# Altium schematic sheet 11_PoE_USB_PD.SchDoc: PoE and USB PD (part 1 of 3)
size A3; Organization: Lime Microsystems; Address1: Surrey Tech Centre; Address2: Guildford GU2 7YG; Address3: Surrey; Address4: United Kingdom; Revision: v1.0; SheetNumber: 11; SheetTotal: 12
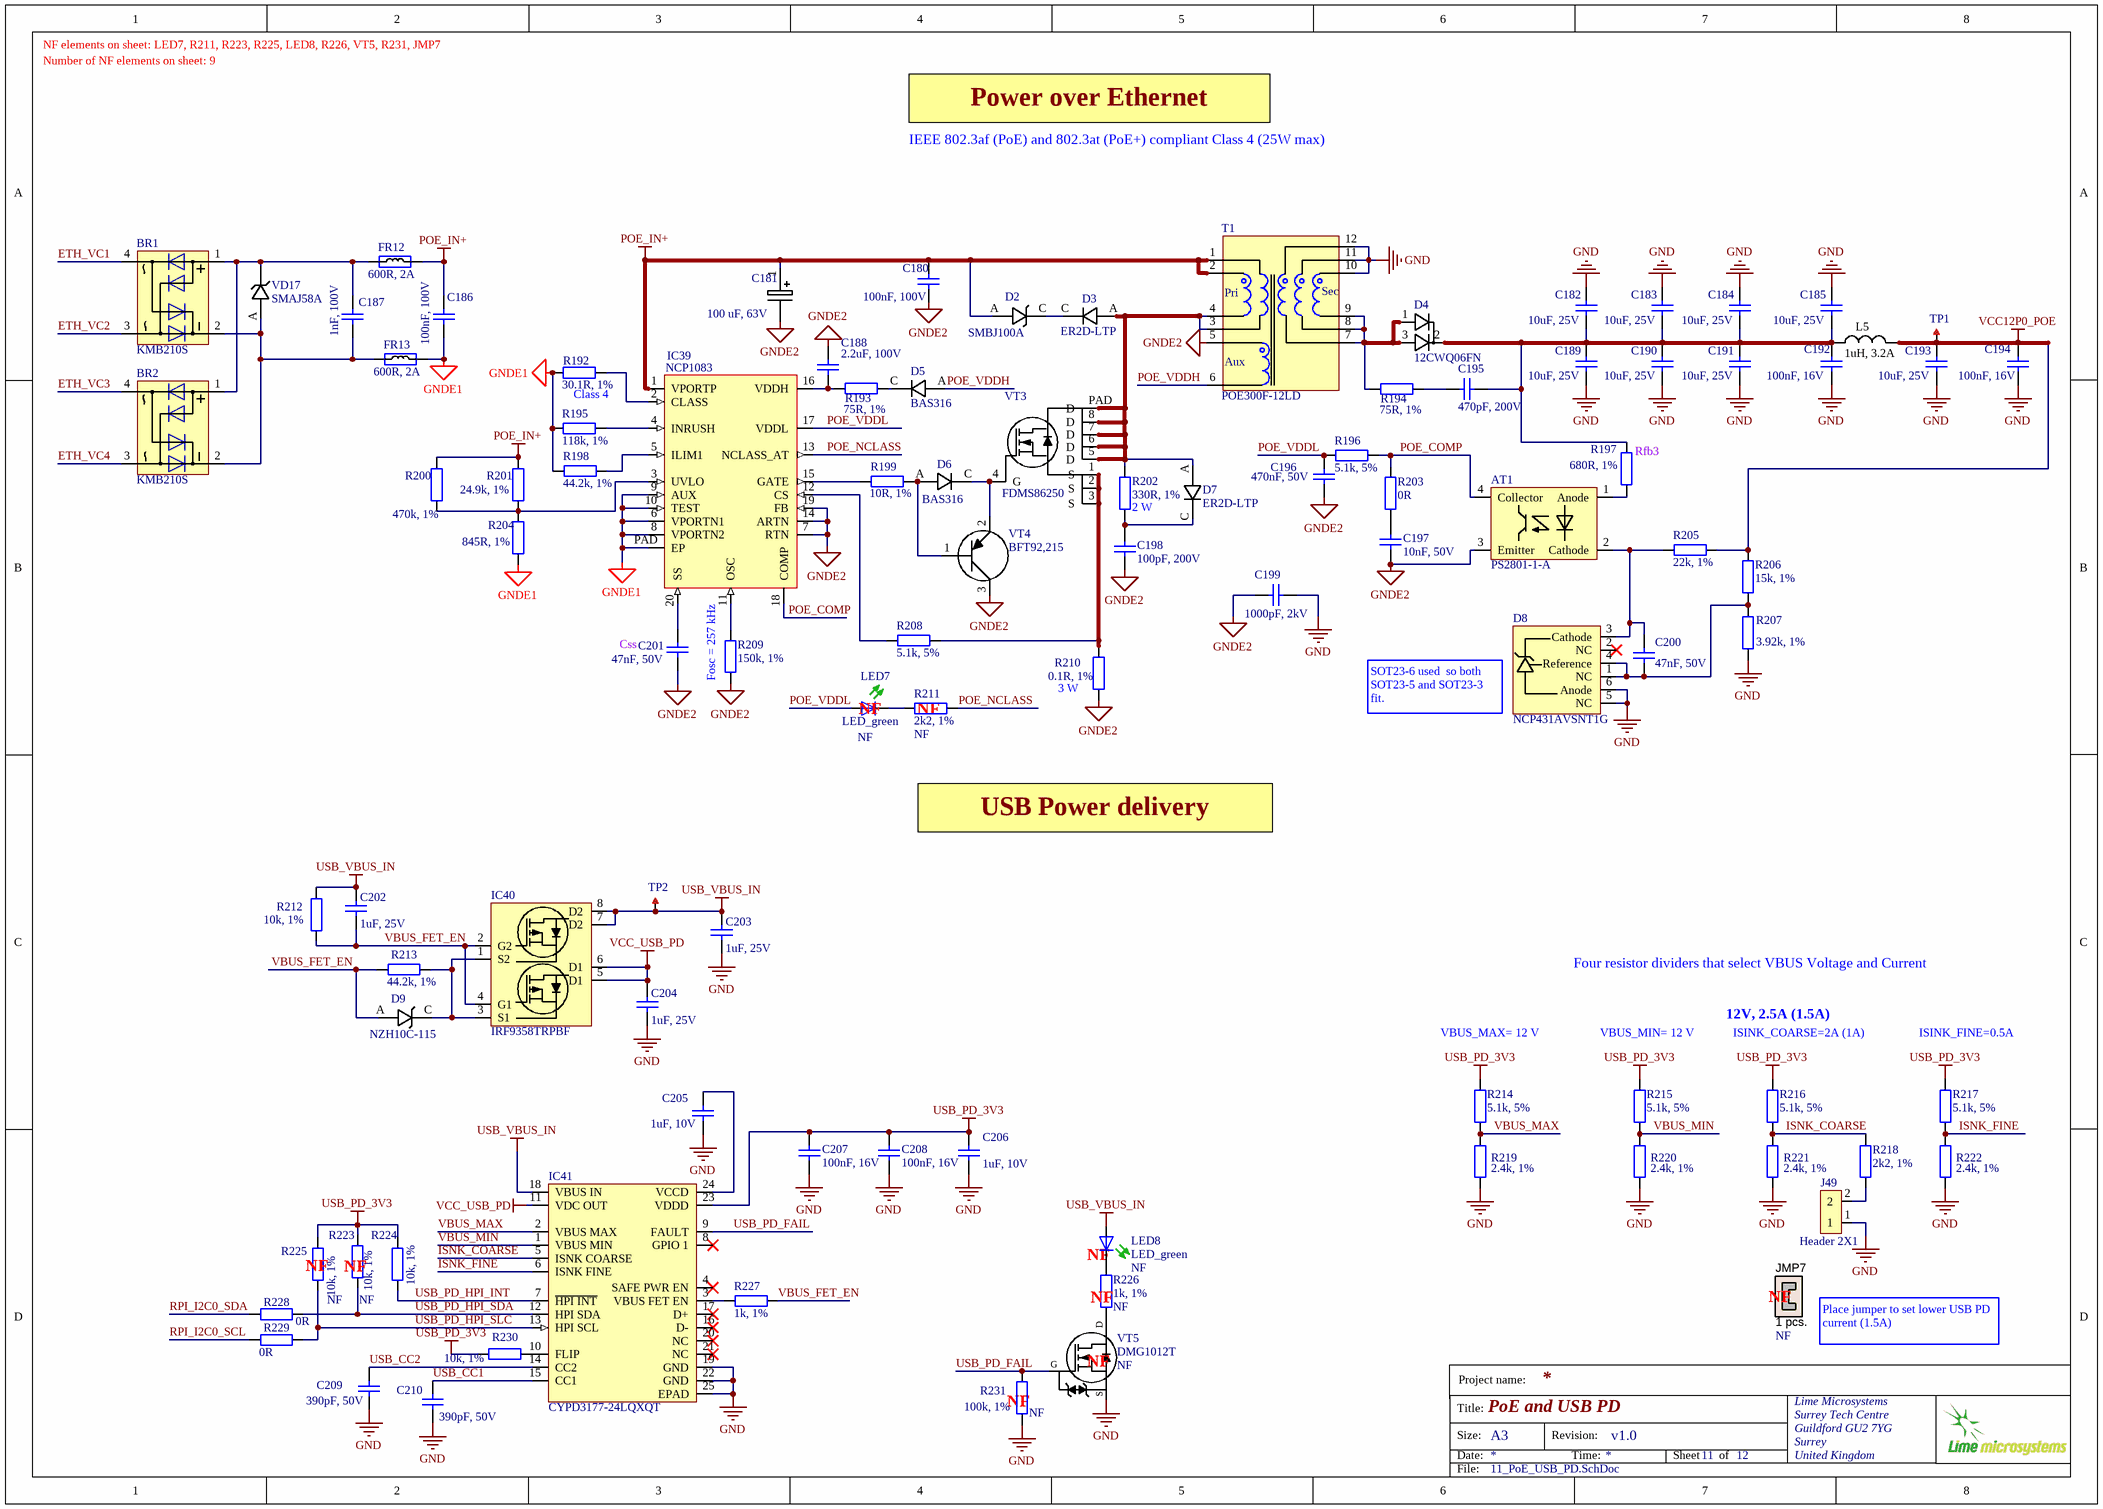
[diagram p0: 11_PoE_USB_PD.SchDoc]

## Parts
AT1  PS2801-1-A  [TCMT1107CT_optoisolator]
BR1  KMB210S  [KMB210S_RECTIFIER_BRIDGE]
BR2  KMB210S  [KMB210S_RECTIFIER_BRIDGE]
C180  100nF, 100V  [CAP0603]
C181  100 uF, 63V  [CAP_POL_D10_H10]
C182  10uF, 25V  [CAP0805]
C183  10uF, 25V  [CAP0805]
C184  10uF, 25V  [CAP0805]
C185  10uF, 25V  [CAP0805]
C186  100nF, 100V  [CAP0603]
C187  1nF, 100V  [CAP0603]
C188  2.2uF, 100V  [CAP1206]
C189  10uF, 25V  [CAP0805]
C190  10uF, 25V  [CAP0805]
C191  10uF, 25V  [CAP0805]
C192  100nF, 16V  [CAP0402]
C193  10uF, 25V  [CAP0805]
C194  100nF, 16V  [CAP0402]
C195  470pF, 200V  [CAP0603]
C196  470nF, 50V  [CAP0402]
C197  10nF, 50V  [CAP0402]
C198  100pF, 200V  [CAP0402]
C199  1000pF, 2kV  [CAP1812]
C200  47nF, 50V  [CAP0603]
C201  47nF, 50V  [CAP0603]
C202  1uF, 25V  [CAP0603]
C203  1uF, 25V  [CAP0603]
C204  1uF, 25V  [CAP0603]
C205  1uF, 10V  [CAP0402]
C206  1uF, 10V  [CAP0402]
C207  100nF, 16V  [CAP0402]
C208  100nF, 16V  [CAP0402]
C209  390pF, 50V  [CAP0402]
C210  390pF, 50V  [CAP0402]
D2  SMBJ100A  [SMBJ100A_DIODE_DO-214AA]
D3  ER2D-LTP  [ER2D-LTP_DIODE_DO-214AA]
D4  12CWQ06FN  [12CWQ06FN_diode_array_DPAK]
D5  BAS316  [BAS316_DIODE_SOD323]
D6  BAS316  [BAS316_DIODE_SOD323]
D7  ER2D-LTP  [ER2D-LTP_DIODE_DO-214AA]
D8  NCP431AVSNT1G  [SOT23-6]
D9  NZH10C-115  [NZH10C,115_shottky_diode_SOD123]
FR12  600R, 2A  [RES0805]
FR13  600R, 2A  [RES0805]
IC39  NCP1083  [NCP1083_PoE_controller_TSSOP20]
IC40  IRF9358TRPBF  [IRF9358TRPBF_DUAL_NMOS_SOIC8]
IC41  CYPD3177-24LQXQT  [USB_POWER_DISTR_CYPD3177_QFN24]
J49  Header 2X1  [HDR_1x2]
JMP7  1 pcs.  Assembly Info: NF  (mechanical)
L5  1uH, 3.2A  [NRS4018T3R3MDGJ_inductor]
LED7  LED_green  Assembly Info: NF  [LED-0603-GREEN]
LED8  LED_green  Assembly Info: NF  [LED-0603-GREEN]
R192  30.1R, 1%  [RES0402]
R193  75R, 1%  [RES0402]
R194  75R, 1%  [RES0402]
R195  118k, 1%  [RES0402]
R196  5.1k, 5%  [RES0402]
R197  680R, 1%  [RES0402]
R198  44.2k, 1%  [RES0402]
R199  10R, 1%  [RES0603]
R200  470k, 1%  [RES0402]
R201  24.9k, 1%  [RES0402]
R202  330R, 1%  [RES0603]
R203  0R  [RES0402]
R204  845R, 1%  [RES0402]
R205  22k, 1%  [RES0402]
R206  15k, 1%  [RES0402]
R207  3.92k, 1%  [RES0402]
R208  5.1k, 5%  [RES0402]
R209  150k, 1%  [RES0402]
R210  0.1R, 1%  [RES2512]
R211  2k2, 1%  Assembly Info: NF  [RES0402]
R212  10k, 1%  [RES0402]
R213  44.2k, 1%  [RES0402]
R214  5.1k, 5%  [RES0402]
R215  5.1k, 5%  [RES0402]
R216  5.1k, 5%  [RES0402]
R217  5.1k, 5%  [RES0402]
R218  2k2, 1%  [RES0402]
R219  2.4k, 1%  [RES0402]
R220  2.4k, 1%  [RES0402]
R221  2.4k, 1%  [RES0402]
R222  2.4k, 1%  [RES0402]
R223  10k, 1%  Assembly Info: NF  [RES0402]
R224  10k, 1%  [RES0402]
R225  10k, 1%  Assembly Info: NF  [RES0402]
R226  1k, 1%  Assembly Info: NF  [RES0402]
R227  1k, 1%  [RES0402]
R228  0R  [RES0402]
R229  0R  [RES0402]
R230  10k, 1%  [RES0402]
R231  100k, 1%  Assembly Info: NF  [RES0402]
T1  POE300F-12LD  [POE300F50LD_TRANSFORMER]
TP1  TESTPOINT_PAD  [TP_PAD_1p5MM]  (value not drawn)  (no BOM)
TP2  TESTPOINT_PAD  [TP_PAD_1p5MM]  (value not drawn)  (no BOM)
VD17  SMAJ58A  [SMAJ58A_shottky_diode]
VT3  FDMS86250  [FDMS86250_NMOS_POWER56]
VT4  BFT92,215  [BFT92,215_PNP_STO23-3]
VT5  DMG1012T  Assembly Info: NF  [SOT523]

## Nets
GND: C182.2 C183.2 C184.2 C185.2 C189.1 C190.1 C191.1 C192.1 C193.1 C194.1 C199.1 C203.1 C204.1 C205.1 C206.1 C207.2 C208.2 C209.2 C210.2 D8.5(NC) D8.6(Anode) IC41.19(GND) IC41.22(GND) IC41.25(EPAD) J49.1 R207.2 R219.1 R220.1 R221.1 R222.1 R231.2 T1.10 T1.11 T1.12 VT5.S
GNDE1: C186.1 FR13.2 IC39.6(VPORTN1) IC39.8(VPORTN2) IC39.9(AUX) IC39.10(TEST) IC39.PAD(EP) R192.1 R195.1 R198.2 R204.2
GNDE2: AT1.3(Emitter) C180.1 C181.2 C188.2 C196.1 C197.1 C198.2 C199.2 C201.1 IC39.7(RTN) IC39.14(ARTN) IC39.19(FB) R209.2 R210.1 T1.5 VT4.3(C)
POE_IN+: C180.2 C181.1 C186.2 D2.A FR12.2 IC39.1(VPORTP) R200.2 R201.2 T1.1 T1.2
USB_PD_3V3: C206.2 C207.1 C208.1 IC41.23(VDDD) R214.1 R215.1 R216.1 R217.1 R223.2 R224.2 R225.2 R230.1
USB_VBUS_IN: C202.2 C203.2 IC40.7(D2) IC40.8(D2) IC41.18(VBUS_IN) LED8.A R212.2 TP2.1
VCC12P0_POE: C193.2 C194.2 L5.2 R205.1 R206.1 TP1.1
VCC_USB_PD: C204.2 IC40.5(D1) IC40.6(D1) IC41.11(VDC_OUT)
ETH_VC1: BR1.4
ETH_VC2: BR1.3
ETH_VC3: BR2.4
ETH_VC4: BR2.3
ISNK_COARSE: IC41.5(ISNK_COARSE) R216.2 R218.2 R221.2
ISNK_FINE: IC41.6(ISNK_FINE) R217.2 R222.2
POE_COMP: AT1.4(Collector) IC39.18(COMP) R196.1 R203.1
POE_NCLASS: IC39.13(NCLASS_AT) R211.2
POE_VDDH: D5.A T1.6
POE_VDDL: C196.2 IC39.17(VDDL) LED7.A R196.2
RPI_I2C0_SCL: R229.2
RPI_I2C0_SDA: R228.2
USB_CC1: C210.1 IC41.15(CC1)
USB_CC2: C209.1 IC41.14(CC2)
USB_PD_FAIL: IC41.9(FAULT) R231.1 VT5.G
USB_PD_HPI_INT: IC41.7(~{HPI_INT}) R224.1
USB_PD_HPI_SDA: IC41.12(HPI_SDA) R223.1 R228.1
USB_PD_HPI_SLC: IC41.13(HPI_SCL) R225.1 R229.1
VBUS_FET_EN: C202.1 D9.A IC40.2(G2) IC40.4(G1) R212.1 R213.2 R227.1
VBUS_MAX: IC41.2(VBUS_MAX) R214.2 R219.2
VBUS_MIN: IC41.1(VBUS_MIN) R215.2 R220.2
NetAT1_1: AT1.1(Anode) R197.2
NetAT1_2: AT1.2(Cathode) C200.2 D8.3(Cathode) R205.2
NetBR1_1: BR1.1 BR2.1 C187.1 FR12.1 VD17.K
NetBR1_2: BR1.2 BR2.2 C187.2 FR13.1 VD17.A
NetC182_1: C182.1 C183.1 C184.1 C185.1 C189.2 C190.2 C191.2 C192.2 C195.2 D4.2 L5.1 R197.1
NetC188_1: C188.1 IC39.16(VDDH) R193.1
NetC195_1: C195.1 R194.2
NetC197_2: C197.2 R203.2
NetC198_1: C198.1 D7.C R202.1
NetC200_1: C200.1 D8.1(NC) D8.4(Reference) R206.2 R207.1
NetC201_2: C201.2 IC39.20(SS)
NetC205_2: C205.2 IC41.24(VCCD)
NetD2_C: D2.C D3.C
NetD3_A: D3.A D7.A R202.2 T1.3 T1.4 VT3.5(D) VT3.6(D) VT3.7(D) VT3.8(D) VT3.PAD(D)
NetD4_1: D4.1 D4.3 R194.1 T1.7 T1.8 T1.9
NetD5_C: D5.C R193.2
NetD6_A: D6.A R199.1 VT4.1(S)
NetD6_C: D6.C VT3.4(G) VT4.2(E)
NetD9_C: D9.C IC40.1(S2) IC40.3(S1) R213.1
NetIC39_2: IC39.2(CLASS) R192.2
NetIC39_3: IC39.3(UVLO) R200.1 R201.1 R204.1
NetIC39_4: IC39.4(INRUSH) R195.2
NetIC39_5: IC39.5(ILIM1) R198.1
NetIC39_11: IC39.11(OSC) R209.1
NetIC39_12: IC39.12(CS) R208.2
NetIC39_15: IC39.15(GATE) R199.2
NetIC41_3: IC41.3(VBUS_FET_EN) R227.2
NetIC41_10: IC41.10(FLIP) R230.2
NetJ49_2: J49.2 R218.1
NetLED7_K: LED7.K(C) R211.1
NetLED8_K: LED8.K(C) R226.2
NetR208_1: R208.1 R210.2 VT3.1(S) VT3.2(S) VT3.3(S)
NetR226_1: R226.1 VT5.D

Not connected (* = marked no-connect by the designer): D8 2(NC)*; IC41 4(SAFE_PWR_EN)* 8(GPIO_1)* 16(D-)* 17(D+)* 20(NC)* 21(NC)*; JMP7 1 2

## Notes on the sheet
- NF elements on sheet: LED7, R211, R223, R225, LED8, R226, VT5, R231, JMP7
- Number of NF elements on sheet: 9
- IEEE 802.3af (PoE) and 802.3at (PoE+) compliant Class 4 (25W max)
- Power over Ethernet
- Class 4
- (near R202) 2 W
- (near R197) Rfb3
- Css
- Fosc = 257 kHz
- (near LED7) NF
- (near R211) NF
- (near R210) 3 W
- SOT23-6 used  so both SOT23-5 and SOT23-3 fit.
- USB Power delivery
- Four resistor dividers that select VBUS Voltage and Current
- (near R214) VBUS_MAX= 12 V
- (near R215) VBUS_MIN= 12 V
- 12V, 2.5A (1.5A)
- (near R216) ISINK_COARSE=2A (1A)
- (near R217) ISINK_FINE=0.5A
- (near LED8) NF
- (near R225) NF
- (near R223) NF
- (near R226) NF
- (near JMP7) NF
- (near VT5) NF
- Place jumper to set lower USB PD current (1.5A)
- (near R231) NF
- Project name:
- Title:
- Size:
- Date:
- A3
- Revision:
- Time:
- Sheet
- of
- File:
- (in symbol POE300F-50LD_transformer) Pri; Sec; Aux